# EAGLE schematic External ADC (EAGLE 8.2.2)
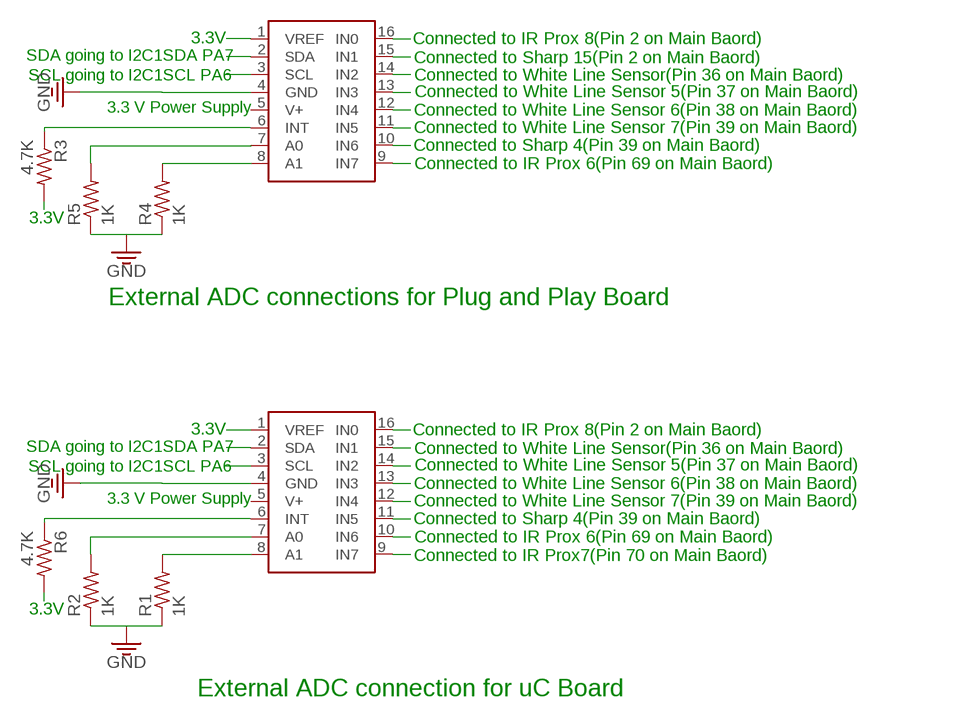
[diagram p0: schematic, sheet 1]

## Parts
R1  1K  R-US_M1206  [M1206]
R2  1K  R-US_M1206  [M1206]
R3  4.7K  R-US_M1206  [M1206]
R4  1K  R-US_M1206  [M1206]
R5  1K  R-US_M1206  [M1206]
R6  4.7K  R-US_M1206  [M1206]
U$1  ADC128D818  [ADC12_SD]
U$4  ADC128D818  [ADC12_SD]

## Nets
1: U$1.16(IN0)
2: U$4.16(IN0)
3: U$1.14(IN2)
4: U$1.13(IN3)
5: U$1.12(IN4)
6: U$1.11(IN5)
7: U$1.9(IN7)
36: U$4.14(IN2)
37: U$4.13(IN3)
38: U$4.12(IN4)
39: U$4.11(IN5)
69: U$4.9(IN7)
EX1: U$4.15(IN1)
EX2: U$1.10(IN6)
EX3: U$1.15(IN1)
EX6: U$4.10(IN6)
GND [5V1]: R4.1 R5.1
GND1 [5V1]: R1.1 R2.1
N$1: U$4.4(GND)
N$6: U$1.4(GND)
N$9: R2.2
N$10: R1.2
N$18: R5.2
N$19: R4.2
Unconnected: R3.1 R3.2 R6.1 R6.2 U$1.1(VREF) U$1.2(SDA) U$1.3(SCL) U$1.5(V+) U$1.6(INT) U$1.7(A0) U$1.8(A1) U$4.1(VREF) U$4.2(SDA) U$4.3(SCL) U$4.5(V+) U$4.6(INT) U$4.7(A0) U$4.8(A1)

## Notes on the sheet
- 3.3V | Connected to IR Prox 8(Pin 2 on Main Baord)
- SDA going to I2C1SDA PA7 | Connected to Sharp 15(Pin 2 on Main Baord)
- SCL going to I2C1SCL PA6 | Connected to White Line Sensor(Pin 36 on Main Baord)
- Connected to White Line Sensor 5(Pin 37 on Main Baord)
- 3.3 V Power Supply | Connected to White Line Sensor 6(Pin 38 on Main Baord)
- Connected to White Line Sensor 7(Pin 39 on Main Baord)
- Connected to Sharp 4(Pin 39 on Main Baord)
- Connected to IR Prox 6(Pin 69 on Main Baord)
- 3.3V
- External ADC connections for Plug and Play Board
- 3.3V | Connected to IR Prox 8(Pin 2 on Main Baord)
- SDA going to I2C1SDA PA7 | Connected to White Line Sensor(Pin 36 on Main Baord)
- SCL going to I2C1SCL PA6 | Connected to White Line Sensor 5(Pin 37 on Main Baord)
- Connected to White Line Sensor 6(Pin 38 on Main Baord)
- 3.3 V Power Supply | Connected to White Line Sensor 7(Pin 39 on Main Baord)
- Connected to Sharp 4(Pin 39 on Main Baord)
- Connected to IR Prox 6(Pin 69 on Main Baord)
- Connected to IR Prox7(Pin 70 on Main Baord)
- 3.3V
- External ADC connection for uC Board

## Library data of the parts
R1-R6 = rcl:R-US_: RESISTOR, American symbol
U$1 U$4 = ADC128D818:ADC128D818

## Net classes
0 default: width 0.2 mm, clearance 0.2 mm
1 5V1: width 1 mm, clearance 0.2 mm
2 3.3V: width 1 mm, clearance 0.2 mm